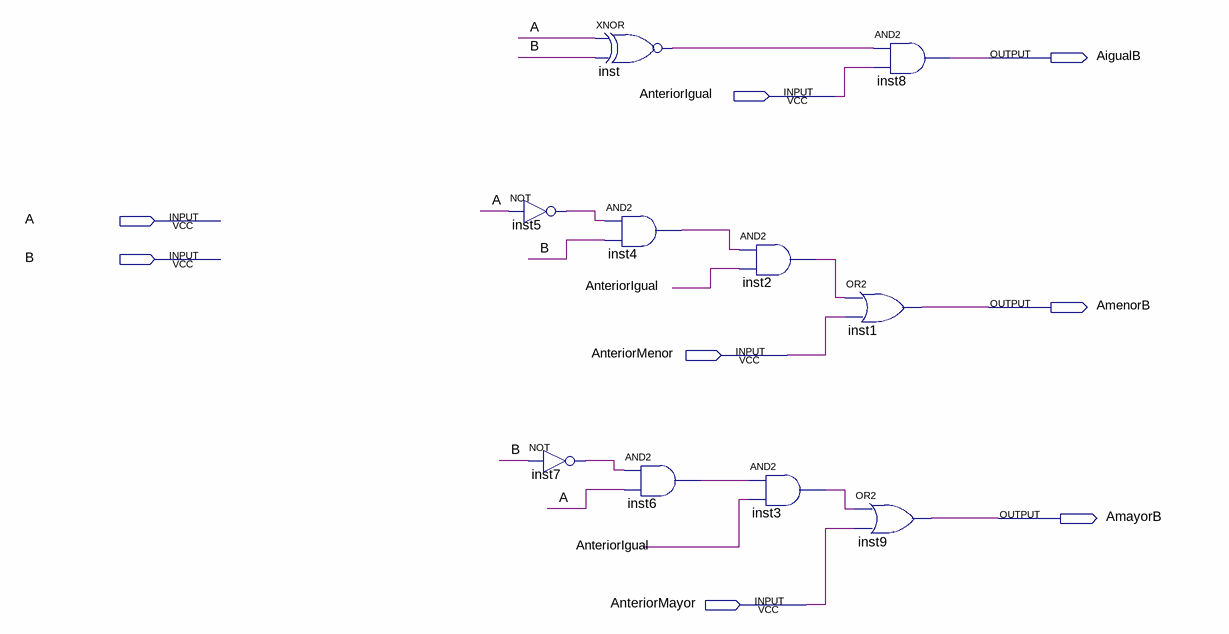
[diagram p0: schematic sheet]
// Quartus schematic Comparador1bit.bdf as structural Verilog: 10 symbols, 8 pins
module Comparador1bit (
  input  AnteriorIgual,
  input  A,
  input  B,
  input  AnteriorMenor,
  input  AnteriorMayor,
  output AigualB,
  output AmenorB,
  output AmayorB
);

  wire inst2_out, inst3_out, inst4_out, inst5_out, inst6_out, inst7_out, inst_out;

  not inst5 (inst5_out, A);
  not inst7 (inst7_out, B);
  xnor inst (inst_out, A, B);
  and inst4 (inst4_out, inst5_out, B);
  and inst6 (inst6_out, inst7_out, A);
  and inst2 (inst2_out, inst4_out, AnteriorIgual);
  and inst3 (inst3_out, inst6_out, AnteriorIgual);
  or inst1 (AmenorB, inst2_out, AnteriorMenor);
  or inst9 (AmayorB, inst3_out, AnteriorMayor);
  and inst8 (AigualB, inst_out, AnteriorIgual);
endmodule
